# EAGLE design sensorboard (EAGLE 6.4)
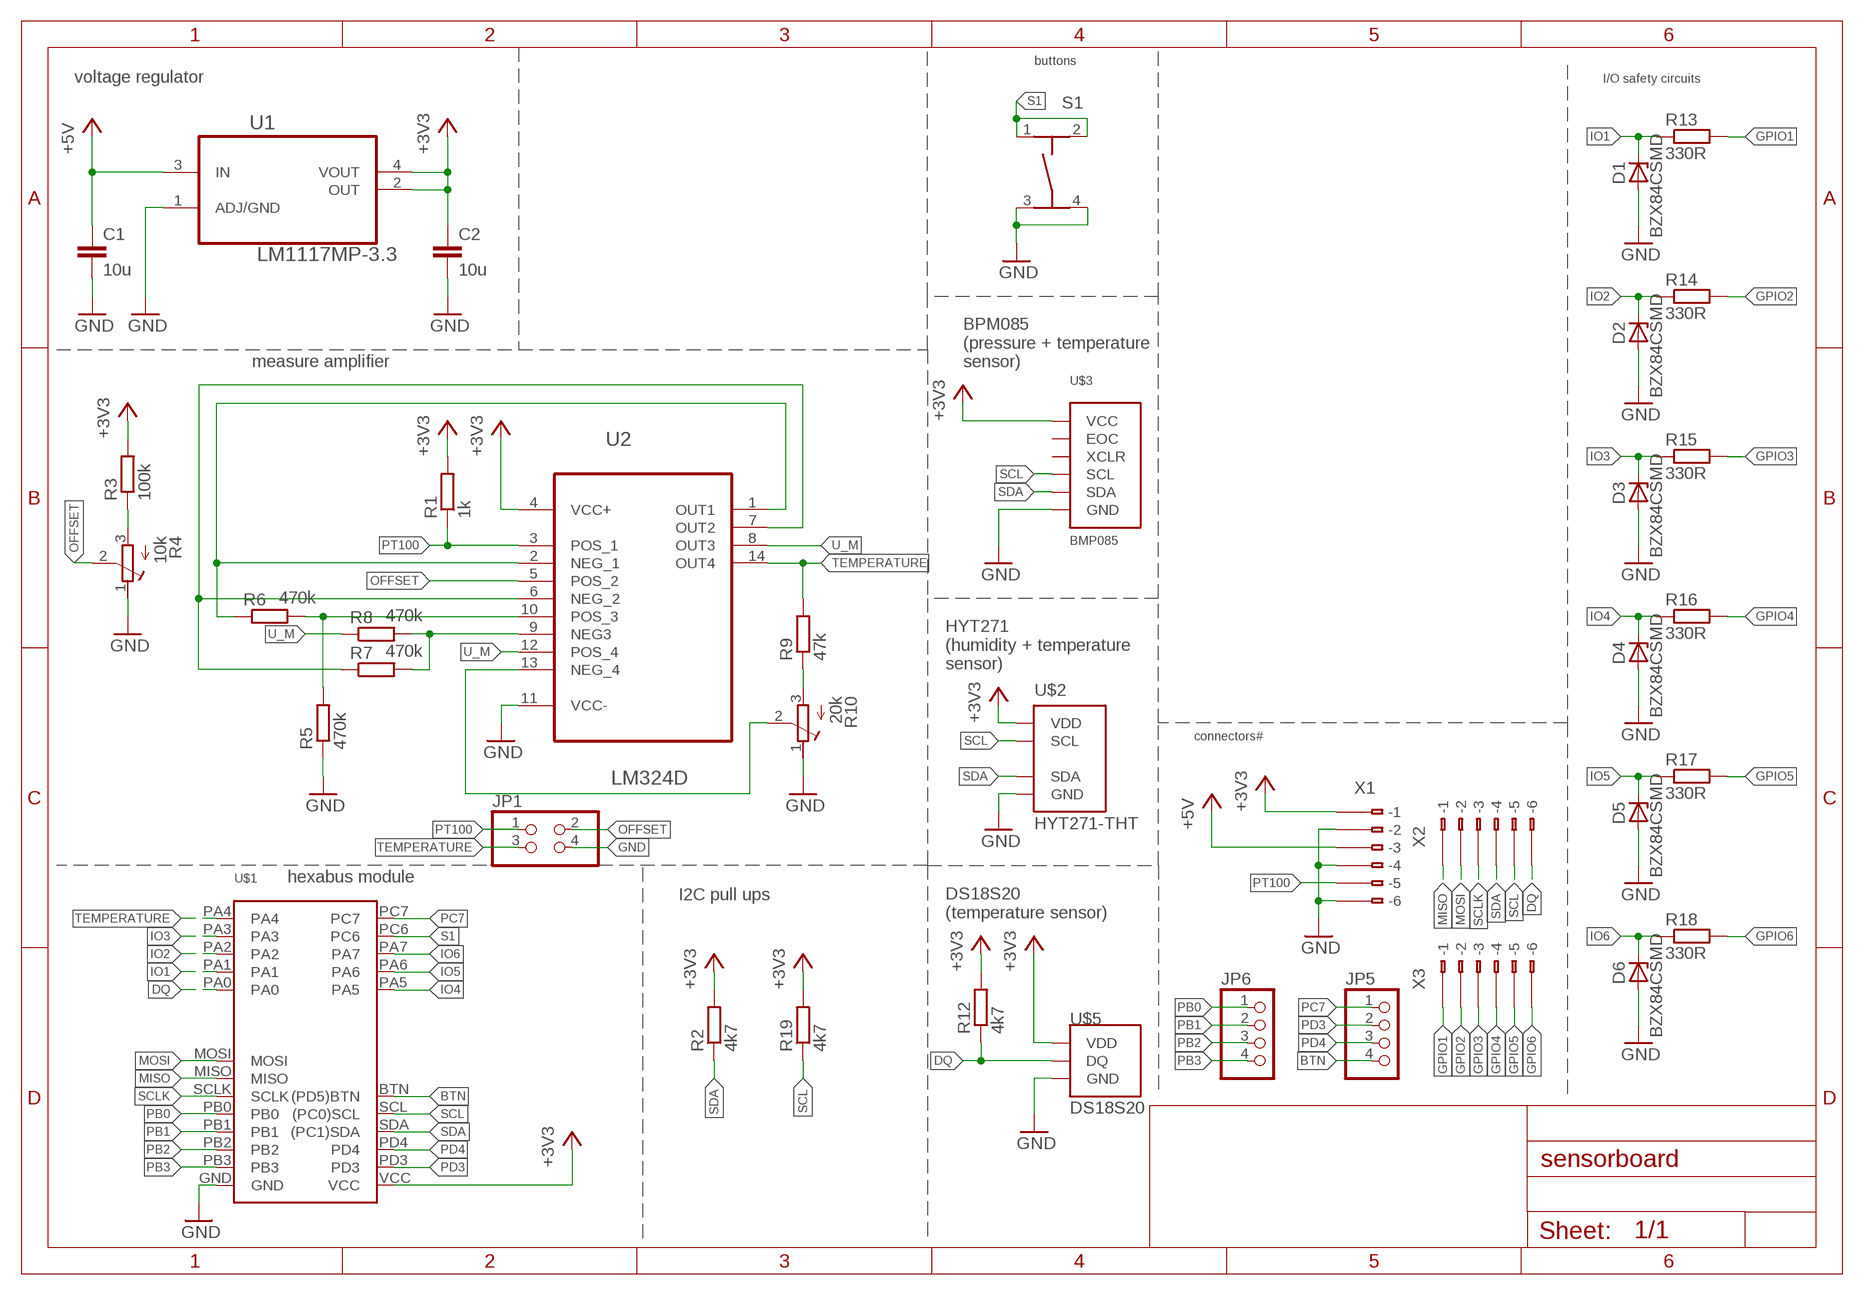
[diagram p0: schematic, sheet 1]

## Parts
C1  10u  C-EUC0805  [C0805]
C2  10u  C-EUC0805  [C0805]
D1  BZX84CSMD  [TO236]
D2  BZX84CSMD  [TO236]
D3  BZX84CSMD  [TO236]
D4  BZX84CSMD  [TO236]
D5  BZX84CSMD  [TO236]
D6  BZX84CSMD  [TO236]
JP1  PINHD-2X2  [2X02]
JP5  PINHD-1X4  [1X04]
JP6  PINHD-1X4  [1X04]
R1  1k  R-EU_R0805  [R0805]
R2  4k7  R-EU_R0805  [R0805]
R3  100k  R-EU_R0805  [R0805]
R4  10k  R-TRIMMT93YB  [RTRIMT93YB]
R5  470k  R-EU_R0805  [R0805]
R6  470k  R-EU_R0805  [R0805]
R7  470k  R-EU_R0805  [R0805]
R8  470k  R-EU_R0805  [R0805]
R9  47k  R-EU_R0805  [R0805]
R10  20k  R-TRIMMT93YB  [RTRIMT93YB]
R12  4k7  R-EU_R0805  [R0805]
R13  330R  R-EU_R0805  [R0805]
R14  330R  R-EU_R0805  [R0805]
R15  330R  R-EU_R0805  [R0805]
R16  330R  R-EU_R0805  [R0805]
R17  330R  R-EU_R0805  [R0805]
R18  330R  R-EU_R0805  [R0805]
R19  4k7  R-EU_R0805  [R0805]
S1  TASTER-9314_SMD  [TASTER-9314_SMD]
U1  LM1117MP-3.3  [SOT230P696X180-4N]
U2  LM324D  [SOIC127P600X175-14N]
U$1  HEXABUS  [HEXABUS]
U$2  HYT271-THT  [HYT271-THT]
U$3  BMP085  [BREAKOUT]
U$5  DS18S20  [TO-92]
X1  233-206  [233-206]
X2  233-206  [233-206]
X3  233-206  [233-206]

## Nets
+3V3: C2.1 R1.2 R2.2 R3.2 R12.2 R19.2 U1.2(OUT) U1.4(VOUT) U2.4(VCC+) U$1.VCC U$2.VDD U$3.VCC U$5.VDD X1.B1(B-1)
+5V: C1.1 U1.3(IN) X1.B3(B-3)
BTN: JP5.4 U$1.BTN((PD5)BTN)
DQ: R12.1 U$1.PA0 U$5.DQ X2.B6(B-6)
GND: C1.2 C2.2 D1.A D2.A D3.A D4.A D5.A D6.A JP1.4 R4.1(E) R5.1 R10.1(E) S1.3 S1.4 U1.1(ADJ/GND) U2.11(VCC-) U$1.GND U$2.GND U$3.GND U$5.GND X1.B2(B-2) X1.B4(B-4) X1.B6(B-6)
GPIO1: R13.2 X3.B1(B-1)
GPIO2: R14.2 X3.B2(B-2)
GPIO3: R15.2 X3.B3(B-3)
GPIO4: R16.2 X3.B4(B-4)
GPIO5: R17.2 X3.B5(B-5)
GPIO6: R18.2 X3.B6(B-6)
IO1: D1.C R13.1 U$1.PA1
IO2: D2.C R14.1 U$1.PA2
IO3: D3.C R15.1 U$1.PA3
IO4: D4.C R16.1 U$1.PA5
IO5: D5.C R17.1 U$1.PA6
IO6: D6.C R18.1 U$1.PA7
MISO: U$1.MISO X2.B1(B-1)
MOSI: U$1.MOSI X2.B2(B-2)
N$1: R6.1 U2.1(OUT1) U2.2(NEG_1)
N$2: R7.1 U2.6(NEG_2) U2.7(OUT2)
N$3: R5.2 R6.2 U2.10(POS_3)
N$4: R7.2 R8.2 U2.9(NEG3)
N$5: R10.2(S) U2.13(NEG_4)
N$6: R9.1 R10.3(A)
N$7: R3.1 R4.3(A)
OFFSET: JP1.2 R4.2(S) U2.5(POS_2)
PB0: JP6.1 U$1.PB0
PB1: JP6.2 U$1.PB1
PB2: JP6.3 U$1.PB2
PB3: JP6.4 U$1.PB3
PC7: JP5.1 U$1.PC7
PD3: JP5.2 U$1.PD3
PD4: JP5.3 U$1.PD4
PT100: JP1.1 R1.1 U2.3(POS_1) X1.B5(B-5)
S1: S1.1 S1.2 U$1.PC6
SCL: R19.1 U$1.SCL((PC0)SCL) U$2.SCL U$3.SCL X2.B5(B-5)
SCLK: U$1.SCLK X2.B3(B-3)
SDA: R2.1 U$1.SDA((PC1)SDA) U$2.SDA U$3.SDA X2.B4(B-4)
TEMPERATURE: JP1.3 R9.2 U2.14(OUT4) U$1.PA4
U_M: R8.1 U2.8(OUT3) U2.12(POS_4)
Unconnected: U$3.EOC U$3.XCLR X1.A1(-1) X1.A2(-2) X1.A3(-3) X1.A4(-4) X1.A5(-5) X1.A6(-6) X2.A1(-1) X2.A2(-2) X2.A3(-3) X2.A4(-4) X2.A5(-5) X2.A6(-6) X3.A1(-1) X3.A2(-2) X3.A3(-3) X3.A4(-4) X3.A5(-5) X3.A6(-6)

## Notes on the sheet
- buttons
- voltage regulator | I/O safety circuits
- measure amplifier
- BPM085
  (pressure + temperature
  sensor)
- HYT271
  (humidity + temperature
  sensor)
- connectors#
- hexabus module
- I2C pull ups
- DS18S20
  (temperature sensor)

## Library data of the parts
C1 C2 = rcl:C-EU: CAPACITOR, European symbol
D1-D6 = diode:BZX84CSMD: Z DIODE
JP1 = pinhead:PINHD-2X2: PIN HEADER
JP5 JP6 = pinhead:PINHD-1X4: PIN HEADER
R1-R3 R5-R9 R12-R19 = rcl:R-EU_: RESISTOR, European symbol
R4 R10 = rcl:R-TRIMM: Trimm resistor
S1 = Ergaenzung:TASTER-9314_SMD
U1 = hexasense:LM1117MP-3.3: Linear regulators; MPN: LM1117MP-3.3; OC_FARNELL: 9778195; OC_NEWARK: 41K3470; PACKAGE: SOT223-3; SUPPLIER: NationalSemiconductor
U2 = hexasense:LM324D: Low power quad operational amplifiers; MPN: LM324D; OC_FARNELL: 1467655; OC_NEWARK: 72K8847; PACKAGE: SOIC-14; SUPPLIER: STMicroelectronics
U$1 = hexabus:HEXABUS
U$2 = humidity:HYT271-THT
U$3 = humidity:BMP085
U$5 = dallas:DS18S20
X1-X3 = con-wago:233-206: WAGO Cage Clamp; MPN: 233-206; OC_FARNELL: 1283536; OC_NEWARK: 28K9063

## Board
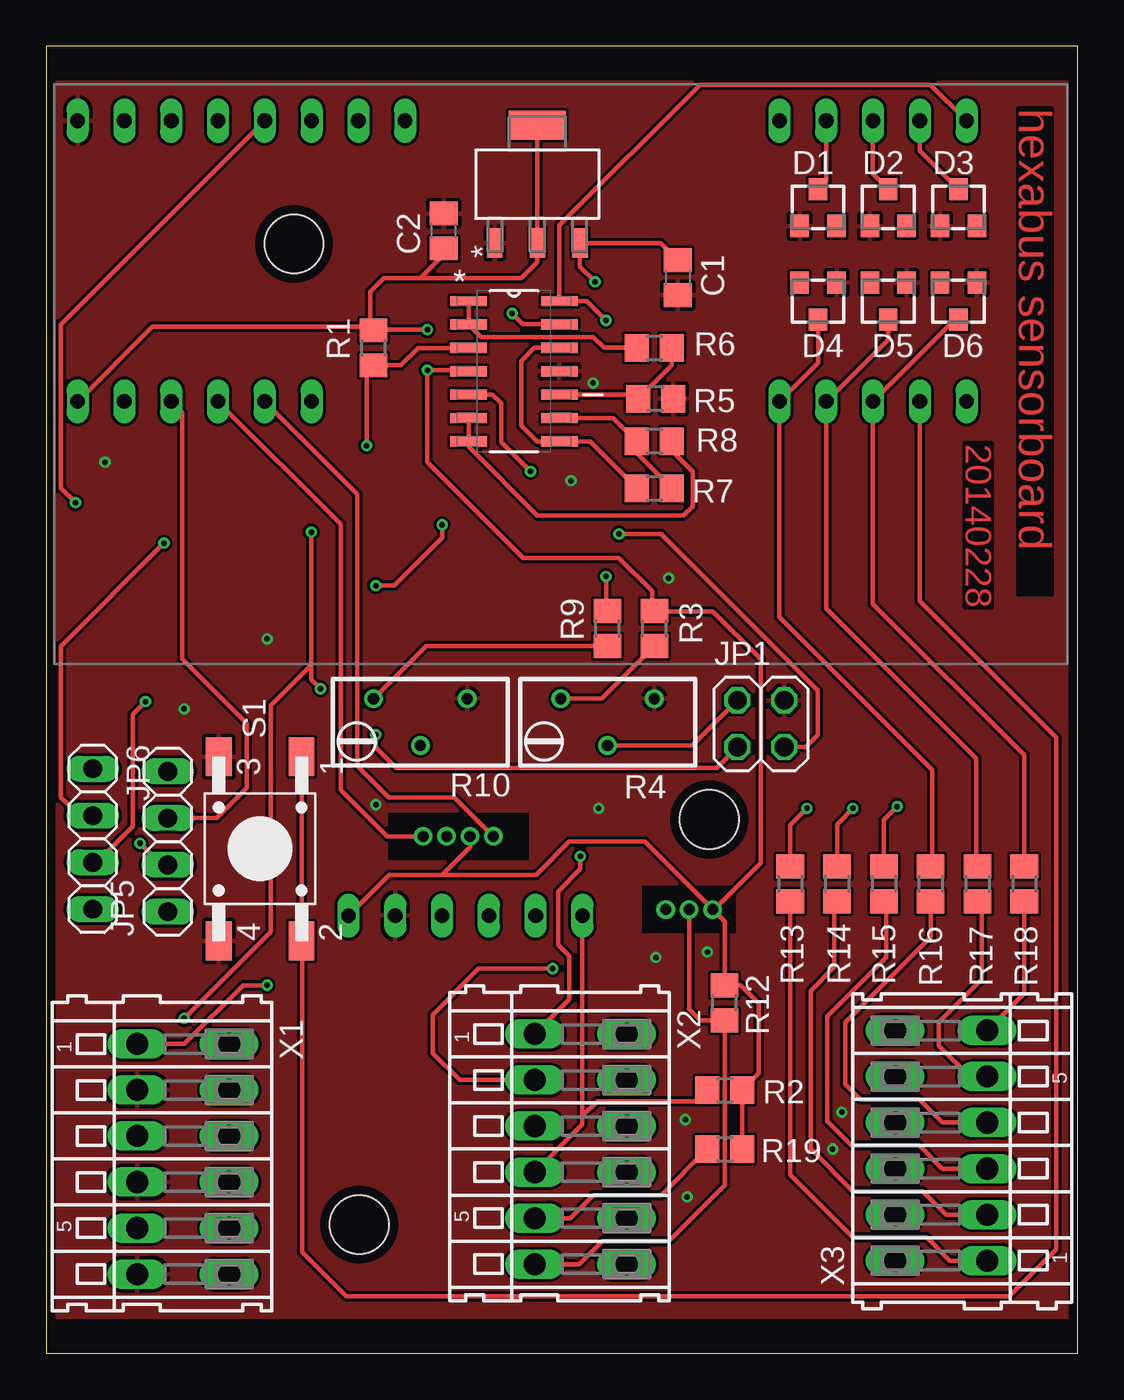
[diagram p1: board, top side]
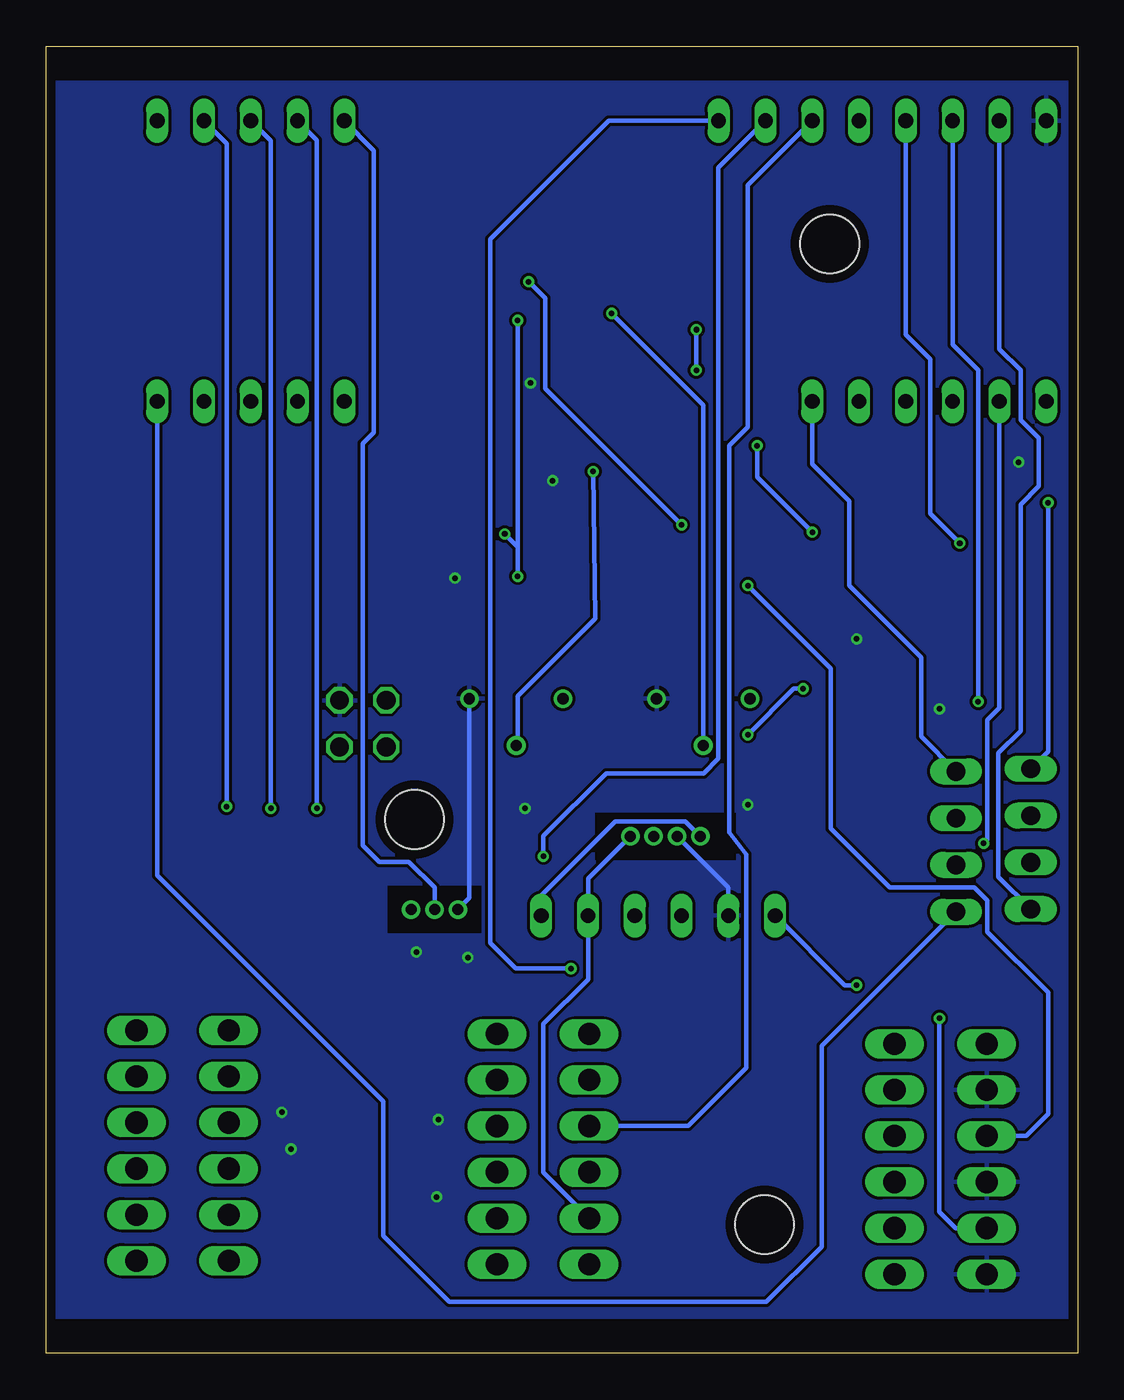
[diagram p2: board, bottom side, seen from below]

Size 56 x 71 mm. Coordinates in mm from the lower left corner, seen from the top.
Outline: 0,0 56,0 56,71 0,71 0,0
Copper layers (1*16): Top 0.035mm / dielectric 1.5mm / Bottom 0.035mm
Design rules "leiton": minimum track width 6mil, minimum drill 0.3mm, track to track 6mil, track to pad 6mil, pad to pad 6mil, via to via 6mil, smd to smd 6mil, copper to edge 20mil, drill to drill 8mil, minimum pad ring 8mil, minimum via ring 6mil, stop-mask expansion 3mil, vias tented up to drill 0mil, thermal gap 8mil
Holes 3.2 mm at 17,7 36,29 13.46,60.25

### Footprints (pad centres in the part's own frame; a part is rotated, then mirrored left to right if it is on the bottom)
C0805 = smd 1.3 x 1.5: 1 -0.95,0; 2 0.95,0
TO236 = smd 1 x 1.2: A -1,-1; C 0,1; NC 1,-1
2X02 = drill 1.016 octagon: 1 -1.27,-1.27; 2 -1.27,1.27; 3 1.27,-1.27; 4 1.27,1.27
1X04 = drill 1.016 long: 1 -3.81,0; 2 -1.27,0; 3 1.27,0; 4 3.81,0
R0805 = smd 1.3 x 1.5: 1 -0.95,0; 2 0.95,0
RTRIMT93YB = drill 0.61: 1 1.27,-2.54; 2 -1.27,0; 3 1.27,2.54
TASTER-9314_SMD = smd 2.1 x 1.4: 1 -5,2.25; 2 5,2.25; 3 -5,-2.25; 4 5,-2.25
SOT230P696X180-4N = smd 1.6 x 0.838: 1 -3.2,2.311; 2 -3.2,0; 3 -3.2,-2.311 | smd 1.6 x 3.099: 4 3.2,0
SOIC127P600X175-14N = smd 1.981 x 0.559: 1 -2.464,3.81; 2 -2.464,2.54; 3 -2.464,1.27; 4 -2.464,0; 5 -2.464,-1.27; 6 -2.464,-2.54; 7 -2.464,-3.81; 8 2.464,-3.81; 9 2.464,-2.54; 10 2.464,-1.27; 11 2.464,0; 12 2.464,1.27; 13 2.464,2.54; 14 2.464,3.81
HEXABUS = drill 0.8 long: BTN 1.49,-13.53; GND -13.75,-26.23; MISO -13.75,-10.99; MOSI -13.75,-8.45; PA0 -13.75,11.87; PA1 -13.75,14.41; PA2 -13.75,16.95; PA3 -13.75,19.49; PA4 -13.75,22.03; PA5 1.49,11.87; PA6 1.49,14.41; PA7 1.49,16.95; PB0 -13.75,-16.07; PB1 -13.75,-18.61; PB2 -13.75,-21.15; PB3 -13.75,-23.69; PC6 1.49,19.49; PC7 1.49,22.03; PD3 1.49,-23.69; PD4 1.49,-21.15; SCL 1.49,-16.07; SCLK -13.75,-13.53; SDA 1.49,-18.61; VCC 1.49,-26.23
HYT271-THT = drill 0.6: GND -0.635,0; SCL 1.905,0; SDA -1.905,0; VDD 0.635,0
BREAKOUT = drill 0.8 long: EOC -1.27,6.35; GND -3.81,6.35; SCL 3.81,6.35; SDA 6.35,6.35; VCC -6.35,6.35; XCLR 1.27,6.35
TO-92 = drill 0.6: DQ 0,0; GND -1.27,0; VDD 1.27,0
233-206 = drill 1.2 long: A1 -6.25,2.5; A2 -3.75,2.5; A3 -1.25,2.5; A4 1.25,2.5; A5 3.75,2.5; A6 6.25,2.5; B1 -6.25,-2.5; B2 -3.75,-2.5; B3 -1.25,-2.5; B4 1.25,-2.5; B5 3.75,-2.5; B6 6.25,-2.5

### Placement (x,y rotation side)
C1  34.29,58.42 270 top
C2  21.59,60.96 90 top
D1  41.91,62.23 0 top
D2  45.72,62.23 0 top
D3  49.53,62.23 0 top
D4  41.91,57.15 180 top
D5  45.72,57.15 180 top
D6  49.53,57.15 180 top
JP1  38.8,34.2 0 top
JP5  6.61,27.8 90 top
JP6  2.54,27.94 270 top
R1  17.78,54.61 90 top
R2  36.85,14.3 0 top
R3  33.02,39.37 90 top
R4  30.48,34.29 90 top
R5  33.09,51.84 180 top
R6  33.02,54.61 0 top
R7  33.02,49.53 180 top
R8  33.02,46.99 0 top
R9  30.48,39.37 90 top
R10  20.32,34.29 90 top
R12  36.83,19.05 90 top
R13  40.4,25.5 270 top
R14  42.94,25.5 270 top
R15  45.48,25.5 270 top
R16  48.02,25.5 270 top
R17  50.56,25.5 270 top
R18  53.1,25.5 270 top
R19  36.85,11.1 0 top
S1  11.62,27.4 270 top
U1  26.67,63.5 90 top
U2  25.4,53.34 0 top
U$1  27.94,53.19 270 top
U$2  22.38,28.08 0 top
U$3  22.77,17.43 0 top
U$5  34.91,24.11 0 top
X1  7.44,10.56 270 top
X2  29.02,11.1 270 top
X3  48.59,11.29 90 top

### Tracks (layer width: path | path; a pad name or v marks a point on that pad's centre or on a via)
+3V3  (via drill 0.3)
  Top 0.254: 20.32,58.4 25.8,58.4 26.67,59.27 U1.2 U1.4 | 20.32,58.4 18.34,58.4 17.59,57.65 17.59,55.75 | U$3.VCC 18.64,26 21.5,26 | 21.5,26 23.02,27.52 U$2.VDD | X1.B1 7.51,16.81 10.7,20 v12,20 | R1.2 17.59,55.75 | U2.4 22.88,53.4 v20.7,53.4 20.7,48.4 25.9,43.2 31.1,43.2 32.9,41.4 32.9,40.44 R3.2 | U$5.VDD 36.83,23.46 R12.2 37.7,20 38.7,19 38.7,15.2 R2.2 R19.2 | C2.1 21.59,59.67 20.32,58.4 | R3.2 33.02,40.64 | 17.59,55.75 5.76,55.75 U$1.VCC | U$5.VDD 32.49,27.8 28.4,27.8 26.6,26 21.5,26 | R3.2 33.04,40.3 36.2,40.3 38.8,37.7 38.8,26.63 36.28,24.11 U$5.VDD | 17.84,55.5 R1.2 | v20.7,55.6 17.82,55.6 R1.2
  Bottom 0.254: v20.7,53.4 v20.7,55.6 | v12,20 12.64,20 U$3.VCC
+5V  (via drill 0.3)
  Top 0.254: C1.1 33.36,60.3 U1.3 28.98,59.02 v29.8,58.2 | v17.9,41.7 18.9,41.7 21.5,44.3 v21.5,45
  Bottom 0.254: X1.B3 2.79,11.81 1.6,13 1.6,19.6 4.9,22.9 4.9,24.6 5.6,25.3 10.2,25.3 13.4,28.5 13.4,37.2 v17.9,41.7 | v29.8,58.2 28.9,57.3 28.9,52.4 v21.5,45
BTN
  Bottom 0.254: JP5.4 8.5,33.5 8.5,37.8 12.4,41.7 12.4,46.3 14.41,48.31 U$1.BTN
DQ
  Top 0.254: U$5.DQ 34.91,18.71 34.9,18.7 35.5,18.1 R12.1 36.83,9.13 33.8,6.1 30.2,6.1 28.95,4.85 X2.B6
  Bottom 0.254: U$5.DQ 34.91,25.31 36.3,26.7 37.9,26.7 38.8,27.6 38.8,49.4 38.2,50 38.2,65.33 U$1.PA0
GND  (via drill 0.3)
  Bottom 0.254: U$2.GND 18.96,25.3 U$3.GND | R4.1 33.02,24.73 U$5.GND
  other vias: 12,38.8 7.5,35 28.5,47.4 17.9,29.8 35.9,21.8 43.2,13.1 42.7,11.1 29.7,52.7 3.2,48.4 33.1,21.5 34.7,12.7 34.8,8.5 30,29.6 33.8,42.1
  pour Top: 0,2 56,2 56,69 0,69
  pour Bottom: 0,2 56,2 56,69 0,69
GPIO1
  Top 0.254: 40.6,24.35 R13.2 | 40.9,24.05 R13.2 | R13.2 40.4,9.7 43.8,6.3 47.8,6.3 49.06,5.04 X3.B1
GPIO2
  Top 0.254: X3.B2 48.86,7.54 47.6,8.8 43.8,8.8 41.5,11.1 41.5,19.7 42.8,21 42.8,24.41 R14.2
GPIO3
  Top 0.254: X3.B3 48.66,10.04 47.4,11.3 43.7,11.3 42.4,12.6 42.4,18.3 45.6,21.5 45.6,24.43 R15.2
GPIO4
  Top 0.254: R16.2 48.02,22.62 43.38,17.98 43.38,14.62 44.2,13.8 47.4,13.8 48.66,12.54 X3.B4
GPIO5
  Top 0.254: 50.6,24.51 R17.2 50.8,24.31 50.8,20.32 48.46,17.98 48.46,16.71 50.13,15.04 X3.B5
GPIO6
  Top 0.254: X3.B6 53.1,19.55 R18.2
IO1  (via drill 0.3)
  Top 0.254: U$1.PA1 42.35,63.67 D1.C | R13.1 40.4,28.7 v41.3,29.6
  Bottom 0.254: v41.3,29.6 41.3,65.89 U$1.PA1
IO2  (via drill 0.3)
  Top 0.254: U$1.PA2 44.89,64.06 D2.C | R14.1 42.94,28.74 v43.8,29.6
  Bottom 0.254: v43.8,29.6 43.8,65.85 U$1.PA2
IO3  (via drill 0.3)
  Top 0.254: U$1.PA3 47.43,65.33 D3.C | R15.1 45.48,28.98 v46.2,29.7
  Bottom 0.254: v46.2,29.7 46.2,65.71 U$1.PA3
IO4
  Top 0.254: D4.C 41.91,53.8 U$1.PA5 39.81,39.99 48.1,31.7 48.1,26.53 R16.1
IO5
  Top 0.254: D5.C 45.72,55.07 U$1.PA6 42.35,40.45 50.5,32.3 50.5,26.51 R17.1
IO6
  Top 0.254: D6.C 49.34,56.15 U$1.PA7 44.89,40.71 53.1,32.5 R18.1
MISO  (via drill 0.3)
  Top 0.254: v29,27 29,26.3 27.8,25.1 27.8,22.2 28.4,21.6 28.4,19.23 X2.B1
  Bottom 0.254: U$1.MISO 19.5,64.39 19.5,32.3 20.3,31.5 25.6,31.5 29,28.1 v29,27
MOSI  (via drill 0.3)
  Top 0.254: v27.5,20.9 23.5,20.9 21,18.4 21,16.3 22.45,14.85 X2.B2
  Bottom 0.254: U$1.MOSI 25.46,66.94 31.9,60.5 31.9,22.3 30.5,20.9 v27.5,20.9
N$1
  Top 0.254: U2.1 U2.2 23.62,55.2 29.7,55.2 30.29,54.61 R6.1
N$2
  Top 0.254: U2.6 U2.7 22.94,49.24 26.67,45.5 34.6,45.5 35.1,46 35.1,47.9 33.97,49.03 R7.1
N$3
  Top 0.254: R6.2 33.97,53.67 R5.2 31.91,52.07 U2.10
N$4
  Top 0.254: R8.2 32.07,48.89 R7.2 30.8,50.8 U2.9
N$5  (via drill 0.3)
  Top 0.254: U2.13 27.86,55.9 25.88,55.9 v25.3,56.48
  Bottom 0.254: R10.2 20.32,51.5 v25.3,56.48
N$6
  Top 0.254: R9.1 20.64,38.42 R10.3
N$7
  Top 0.254: R3.1 30.16,35.56 R4.3
OFFSET  (via drill 0.3)
  Top 0.254: U2.5 24.23,52.07 24.7,51.6 24.7,49.5 v26.3,47.9 | R4.2 35.08,33.02 JP1.2
  Bottom 0.254: v26.3,47.9 26.2,39.9 30.4,35.7 30.4,33.1 R4.2
PB0  (via drill 0.3)
  Top 0.254: U$1.PB0 0.8,55.87 0.8,47 v1.6,46.2
  Bottom 0.254: v1.6,46.2 1.6,32.69 JP6.1
PB1  (via drill 0.3)
  Top 0.254: JP6.2 1.89,29.21 0.8,30.2 0.8,38.4 v6.4,44
  Bottom 0.254: U$1.PB1 9.33,55.33 8,54 8,45.6 v6.4,44
PB2  (via drill 0.3)
  Top 0.254: JP6.3 2.74,26.67 4.7,28.63 4.7,34.7 v5.4,35.4
  Bottom 0.254: U$1.PB2 6.79,54.79 5.4,53.4 v5.4,35.4
PB3
  Bottom 0.254: U$1.PB3 4.25,54.55 3.1,53.4 3.1,50.7 2.1,49.7 2.1,47.1 3.1,46.1 3.1,33.8 4.3,32.6 4.3,25.89 JP6.4
PC7
  Bottom 0.254: U$1.PC7 49.97,25.97 37.7,13.7 37.7,6.4 34.1,2.8 16.9,2.8 13.9,5.8 13.9,16.7 JP5.1
PD3  (via drill 0.3)
  Top 0.254: JP5.2 6.27,26.53 v5.1,27.7
  Bottom 0.254: U$1.PD3 4.25,35.05 4.9,34.4 4.9,27.9 v5.1,27.7
PD4
  Top 0.254: U$1.PD4 7.4,51.09 7.4,37.7 10.9,34.2 10.9,30.7 9.27,29.07 JP5.3
PT100  (via drill 0.3)
  Top 0.254: 14.4,37.4 12.2,35.2 12.2,22.9 v7.5,18.2 | 14.4,37.4 v14.4,44.6 | v17.4,49.3 17.4,53.28 R1.1 19.26,53.66 20.2,54.6 22.93,54.6 U2.3 | v17.9,33.6 17.9,32.9 19,31.8 36.4,31.8 JP1.1 | v14.9,36.1 14.4,36.6 14.4,37.4
  Bottom 0.254: v7.5,18.2 7.5,7.7 6.61,6.81 X1.B5 | v14.4,44.6 17.4,47.6 v17.4,49.3 | v17.9,33.6 15.4,36.1 v14.9,36.1
S1
  Top 0.254: S1.1 S1.2 13.9,22.37 13.9,5.5 16.3,3.1 52.3,3.1 54.85,5.65 54.85,33.45 47.43,40.87 U$1.PC6
SCL
  Top 0.254: U$2.SCL 22.16,30.2 18.6,30.2 16.9,31.9 16.9,46.67 U$1.SCL | X2.B5 28.45,7.35 29.7,8.6 33.4,8.6 R19.1
  Bottom 0.254: U$2.SCL 26.58,25.79 U$3.SCL 26.58,20.32 29,17.9 29,9.83 X2.B5
SCLK
  Bottom 0.254: X2.B3 21.15,12.35 18,15.5 18,27.1 18.9,28.3 18.9,49.3 17.9,50.3 17.9,63.45 U$1.SCLK
SDA
  Top 0.254: U$3.SDA 29.12,12.9 | 29.12,12.9 29.12,12.45 X2.B4 | U$2.SDA 18.52,28.08 16,30.6 16,45.03 U$1.SDA | R2.1 35.3,13.7 29.92,13.7 29.12,12.9
  Bottom 0.254: U$3.SDA 29.12,24.88 25.1,28.9 21.3,28.9 U$2.SDA
TEMPERATURE  (via drill 0.3)
  Top 0.254: U$1.PA4 48.01,68.9 35.5,68.9 27.86,61.26 U2.14 29.35,57.15 v30.4,56.1 | v30.4,42.2 30.4,40.4 R9.2 | JP1.3 41.23,32.93 41.9,33.6 41.9,36 33.4,44.5 v31.1,44.5
  Bottom 0.254: v30.4,42.2 30.4,43.8 | 30.4,43.8 v30.4,56.1 | v31.1,44.5 30.4,43.8
U_M
  Top 0.254: R8.1 29.53,49.53 U2.8 26.67,49.53 25.8,50.4 25.8,53.9 26.51,54.61 U2.12

### Text on the board
Top: hexabus sensorboard | 20140228